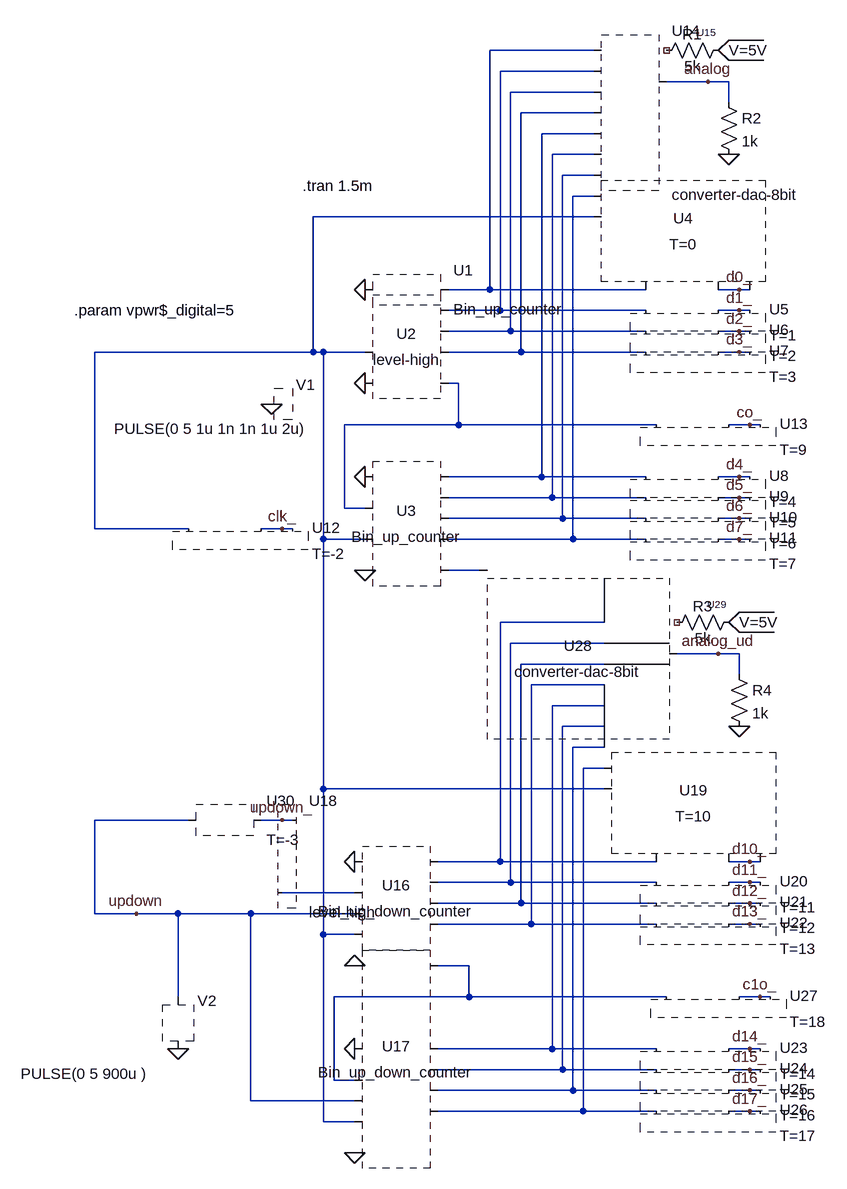
[diagram p0: schematic couter_tst.asc]
couter_tst.asc, the LTspice schematic file:
Version 4
SHEET 1 880 1568
WIRE 528 -240 368 -240
WIRE 528 -208 384 -208
WIRE 704 -192 640 -192
WIRE 736 -192 704 -192
WIRE 528 -176 400 -176
WIRE 736 -160 736 -192
WIRE 528 -144 416 -144
WIRE 528 -112 448 -112
WIRE 528 -80 464 -80
WIRE 528 -48 480 -48
WIRE 528 -16 496 -16
WIRE 528 16 96 16
WIRE 368 128 368 -240
WIRE 368 128 304 128
WIRE 608 128 368 128
WIRE 752 128 720 128
WIRE 768 128 752 128
WIRE 384 160 384 -208
WIRE 384 160 304 160
WIRE 608 160 384 160
WIRE 752 160 720 160
WIRE 768 160 752 160
WIRE 400 192 400 -176
WIRE 400 192 304 192
WIRE 608 192 400 192
WIRE 752 192 720 192
WIRE 768 192 752 192
WIRE 32 224 -240 224
WIRE 96 224 96 16
WIRE 96 224 32 224
WIRE 112 224 96 224
WIRE 176 224 112 224
WIRE 416 224 416 -144
WIRE 416 224 304 224
WIRE 608 224 416 224
WIRE 752 224 720 224
WIRE 768 224 752 224
WIRE 320 272 304 272
WIRE 320 336 320 272
WIRE 320 336 144 336
WIRE 624 336 320 336
WIRE 768 336 736 336
WIRE 784 336 768 336
WIRE 448 416 448 -112
WIRE 448 416 304 416
WIRE 608 416 448 416
WIRE 752 416 720 416
WIRE 768 416 752 416
WIRE 464 448 464 -80
WIRE 464 448 304 448
WIRE 608 448 464 448
WIRE 752 448 720 448
WIRE 768 448 752 448
WIRE 144 464 144 336
WIRE 176 464 144 464
WIRE 480 480 480 -48
WIRE 480 480 304 480
WIRE 608 480 480 480
WIRE 752 480 720 480
WIRE 768 480 752 480
WIRE -240 496 -240 224
WIRE -96 496 -240 496
WIRE 48 496 16 496
WIRE 64 496 48 496
WIRE 112 512 112 224
WIRE 176 512 112 512
WIRE 496 512 496 -16
WIRE 496 512 304 512
WIRE 608 512 496 512
WIRE 752 512 720 512
WIRE 768 512 752 512
WIRE 352 560 304 560
WIRE 544 640 384 640
WIRE 544 672 400 672
WIRE 720 688 656 688
WIRE 752 688 720 688
WIRE 544 704 416 704
WIRE 752 720 752 688
WIRE 544 736 432 736
WIRE 544 768 464 768
WIRE 544 800 480 800
WIRE 544 832 496 832
WIRE 544 864 512 864
WIRE 112 896 112 512
WIRE 544 896 112 896
WIRE -96 944 -240 944
WIRE 48 944 16 944
WIRE 64 944 48 944
WIRE 384 1008 384 640
WIRE 384 1008 288 1008
WIRE 624 1008 384 1008
WIRE 768 1008 736 1008
WIRE 784 1008 768 1008
WIRE 400 1040 400 672
WIRE 400 1040 288 1040
WIRE 624 1040 400 1040
WIRE 768 1040 736 1040
WIRE 784 1040 768 1040
WIRE 160 1056 48 1056
WIRE 416 1072 416 704
WIRE 416 1072 288 1072
WIRE 624 1072 416 1072
WIRE 768 1072 736 1072
WIRE 784 1072 768 1072
WIRE -240 1088 -240 944
WIRE -176 1088 -240 1088
WIRE -112 1088 -176 1088
WIRE 0 1088 -112 1088
WIRE 160 1088 0 1088
WIRE 432 1104 432 736
WIRE 432 1104 288 1104
WIRE 624 1104 432 1104
WIRE 768 1104 736 1104
WIRE 784 1104 768 1104
WIRE 112 1120 112 896
WIRE 160 1120 112 1120
WIRE 336 1168 288 1168
WIRE -112 1216 -112 1088
WIRE 336 1216 336 1168
WIRE 336 1216 128 1216
WIRE 640 1216 336 1216
WIRE 784 1216 752 1216
WIRE 800 1216 784 1216
WIRE 464 1296 464 768
WIRE 464 1296 288 1296
WIRE 624 1296 464 1296
WIRE 768 1296 736 1296
WIRE 784 1296 768 1296
WIRE 480 1328 480 800
WIRE 480 1328 288 1328
WIRE 624 1328 480 1328
WIRE 768 1328 736 1328
WIRE 784 1328 768 1328
WIRE 128 1344 128 1216
WIRE 160 1344 128 1344
WIRE 496 1360 496 832
WIRE 496 1360 288 1360
WIRE 624 1360 496 1360
WIRE 768 1360 736 1360
WIRE 784 1360 768 1360
WIRE 0 1376 0 1088
WIRE 160 1376 0 1376
WIRE 512 1392 512 864
WIRE 512 1392 288 1392
WIRE 624 1392 512 1392
WIRE 768 1392 736 1392
WIRE 784 1392 768 1392
WIRE 112 1408 112 1120
WIRE 160 1408 112 1408
FLAG 176 272 0
FLAG 176 128 0
FLAG 32 304 0
FLAG 176 416 0
FLAG 176 560 0
FLAG 752 128 d0_
FLAG 752 160 d1_
FLAG 752 192 d2_
FLAG 752 224 d3_
FLAG 752 416 d4_
FLAG 752 448 d5_
FLAG 752 480 d6_
FLAG 752 512 d7_
FLAG 48 496 clk_
FLAG 768 336 co_
FLAG 704 -192 analog
FLAG 736 -80 0
FLAG 160 1008 0
FLAG 160 1168 0
FLAG 160 1456 0
FLAG 160 1296 0
FLAG -112 1296 0
FLAG 768 1008 d10_
FLAG 768 1040 d11_
FLAG 768 1072 d12_
FLAG 768 1104 d13_
FLAG 768 1296 d14_
FLAG 768 1328 d15_
FLAG 768 1360 d16_
FLAG 768 1392 d17_
FLAG 784 1216 c1o_
FLAG 720 688 analog_ud
FLAG 752 800 0
FLAG 48 944 updown_
FLAG -176 1088 updown
SYMBOL Source-V 32 208 R0
WINDOW 3 -242 134 Left 0
WINDOW 123 0 0 Left 0
WINDOW 39 0 0 Left 0
SYMATTR Value PULSE(0 5 1u 1n 1n 1u 2u)
SYMATTR InstName V1
SYMBOL EIT_Digital\\probe_dig 608 112 R0
SYMATTR Value T=0
SYMATTR InstName U4
SYMBOL EIT_Digital\\probe_dig 608 144 R0
SYMATTR Value T=1
SYMATTR InstName U5
SYMBOL EIT_Digital\\probe_dig 608 176 R0
SYMATTR Value T=2
SYMATTR InstName U6
SYMBOL EIT_Digital\\probe_dig 608 208 R0
SYMATTR Value T=3
SYMATTR InstName U7
SYMBOL EIT_Digital\\probe_dig 608 400 R0
SYMATTR Value T=4
SYMATTR InstName U8
SYMBOL EIT_Digital\\probe_dig 608 432 R0
SYMATTR Value T=5
SYMATTR InstName U9
SYMBOL EIT_Digital\\probe_dig 608 464 R0
SYMATTR Value T=6
SYMATTR InstName U10
SYMBOL EIT_Digital\\probe_dig 608 496 R0
SYMATTR Value T=7
SYMATTR InstName U11
SYMBOL EIT_Digital\\Bin_up_counter 176 128 R0
SYMATTR InstName U1
SYMBOL EIT_Digital\\Bin_up_counter 176 416 R0
SYMATTR InstName U3
SYMBOL EIT_Digital\\probe_dig -96 480 R0
SYMATTR Value T=-2
SYMATTR InstName U12
SYMBOL EIT_Digital\\level-high 176 176 R0
SYMATTR InstName U2
SYMBOL EIT_Digital\\probe_dig 624 320 R0
SYMATTR Value T=9
SYMATTR InstName U13
SYMBOL EIT_Digital\\converter-dac-8bit 528 -240 R0
SYMATTR InstName U14
SYMBOL res 736 -256 R90
WINDOW 0 7 56 VBottom 0
WINDOW 3 25 56 VTop 0
SYMATTR InstName R1
SYMATTR Value 5k
SYMBOL source-vmarker 720 -240 M0
SYMATTR InstName U15
SYMBOL res 720 -176 R0
SYMATTR InstName R2
SYMATTR Value 1k
SYMBOL EIT_Digital\\Bin_up_down_counter 160 1008 R0
SYMATTR InstName U16
SYMBOL EIT_Digital\\Bin_up_down_counter 160 1296 R0
SYMATTR InstName U17
SYMBOL Source-V -112 1200 R0
WINDOW 3 -242 134 Left 0
WINDOW 123 0 0 Left 0
WINDOW 39 0 0 Left 0
SYMATTR Value PULSE(0 5 900u )
SYMATTR InstName V2
SYMBOL EIT_Digital\\level-high 48 1056 R0
SYMATTR InstName U18
SYMBOL EIT_Digital\\probe_dig 624 992 R0
SYMATTR Value T=10
SYMATTR InstName U19
SYMBOL EIT_Digital\\probe_dig 624 1024 R0
SYMATTR Value T=11
SYMATTR InstName U20
SYMBOL EIT_Digital\\probe_dig 624 1056 R0
SYMATTR Value T=12
SYMATTR InstName U21
SYMBOL EIT_Digital\\probe_dig 624 1088 R0
SYMATTR Value T=13
SYMATTR InstName U22
SYMBOL EIT_Digital\\probe_dig 624 1280 R0
SYMATTR Value T=14
SYMATTR InstName U23
SYMBOL EIT_Digital\\probe_dig 624 1312 R0
SYMATTR Value T=15
SYMATTR InstName U24
SYMBOL EIT_Digital\\probe_dig 624 1344 R0
SYMATTR Value T=16
SYMATTR InstName U25
SYMBOL EIT_Digital\\probe_dig 624 1376 R0
SYMATTR Value T=17
SYMATTR InstName U26
SYMBOL EIT_Digital\\probe_dig 640 1200 R0
SYMATTR Value T=18
SYMATTR InstName U27
SYMBOL EIT_Digital\\converter-dac-8bit 544 640 R0
SYMATTR InstName U28
SYMBOL res 752 624 R90
WINDOW 0 7 56 VBottom 0
WINDOW 3 25 56 VTop 0
SYMATTR InstName R3
SYMATTR Value 5k
SYMBOL source-vmarker 736 640 M0
SYMATTR InstName U29
SYMBOL res 736 704 R0
SYMATTR InstName R4
SYMATTR Value 1k
SYMBOL EIT_Digital\\probe_dig -96 928 R0
SYMATTR Value T=-3
SYMATTR InstName U30
TEXT 80 -32 Left 0 !.tran 1.5m
TEXT -272 160 Left 0 !.param vpwr$_digital=5

The netlist it stands for:
* couter_tst.asc
* V1: PULSE(0 5 1u 1n 1n 1u 2u) (symbol Source-V not available, pin order unknown); nets seen at it: 0
* U4: T=0 (symbol EIT_Digital\probe_dig not available, pin order unknown); nets seen at it: d0_, N001, N008, N009
* U5: T=1 (symbol EIT_Digital\probe_dig not available, pin order unknown); nets seen at it: d1_, N002
* U6: T=2 (symbol EIT_Digital\probe_dig not available, pin order unknown); nets seen at it: d2_, N003
* U7: T=3 (symbol EIT_Digital\probe_dig not available, pin order unknown); nets seen at it: d3_, N004
* U8: T=4 (symbol EIT_Digital\probe_dig not available, pin order unknown); nets seen at it: d4_, N005
* U9: T=5 (symbol EIT_Digital\probe_dig not available, pin order unknown); nets seen at it: d5_, N006
* U10: T=6 (symbol EIT_Digital\probe_dig not available, pin order unknown); nets seen at it: d6_, N007
* U11: T=7 (symbol EIT_Digital\probe_dig not available, pin order unknown); nets seen at it: d7_, N008
* U1: Bin_up_counter (symbol EIT_Digital\Bin_up_counter not available, pin order unknown); nets seen at it: 0, N001
* U3: Bin_up_counter (symbol EIT_Digital\Bin_up_counter not available, pin order unknown); nets seen at it: 0, N005, N006, N007, N008, N009, N010, N011
* U12: T=-2 (symbol EIT_Digital\probe_dig not available, pin order unknown); nets seen at it: clk_, N009
* U2: level-high (symbol EIT_Digital\level-high not available, pin order unknown); nets seen at it: 0, N002, N003, N004, N009, N010
* U13: T=9 (symbol EIT_Digital\probe_dig not available, pin order unknown); nets seen at it: co_, N010
* U14: converter-dac-8bit (symbol EIT_Digital\converter-dac-8bit not available, pin order unknown); nets seen at it: analog, N001, N002, N003, N004, N005, N006, N007
R1 P001 NC_01 5k
XU15 P001 vdc_single V=5V  ; pins in
R2 analog 0 1k
* U16: Bin_up_down_counter (symbol EIT_Digital\Bin_up_down_counter not available, pin order unknown); nets seen at it: 0, N009, N012, N013, N014, N015, N020, updown
* U17: Bin_up_down_counter (symbol EIT_Digital\Bin_up_down_counter not available, pin order unknown); nets seen at it: 0, N009, N016, N017, N018, N019, N021, updown
* V2: PULSE(0 5 900u ) (symbol Source-V not available, pin order unknown); nets seen at it: 0, updown
* U18: level-high (symbol EIT_Digital\level-high not available, pin order unknown); nets seen at it: N020, updown_
* U19: T=10 (symbol EIT_Digital\probe_dig not available, pin order unknown); nets seen at it: d10_, N009, N012, N019
* U20: T=11 (symbol EIT_Digital\probe_dig not available, pin order unknown); nets seen at it: d11_, N013
* U21: T=12 (symbol EIT_Digital\probe_dig not available, pin order unknown); nets seen at it: d12_, N014
* U22: T=13 (symbol EIT_Digital\probe_dig not available, pin order unknown); nets seen at it: d13_, N015
* U23: T=14 (symbol EIT_Digital\probe_dig not available, pin order unknown); nets seen at it: d14_, N016
* U24: T=15 (symbol EIT_Digital\probe_dig not available, pin order unknown); nets seen at it: d15_, N017
* U25: T=16 (symbol EIT_Digital\probe_dig not available, pin order unknown); nets seen at it: d16_, N018
* U26: T=17 (symbol EIT_Digital\probe_dig not available, pin order unknown); nets seen at it: d17_, N019
* U27: T=18 (symbol EIT_Digital\probe_dig not available, pin order unknown); nets seen at it: c1o_, N021
* U28: converter-dac-8bit (symbol EIT_Digital\converter-dac-8bit not available, pin order unknown); nets seen at it: analog_ud, N011, N012, N013, N014, N015, N016, N017, N018
R3 P002 NC_02 5k
XU29 P002 vdc_single V=5V  ; pins in
R4 analog_ud 0 1k
* U30: T=-3 (symbol EIT_Digital\probe_dig not available, pin order unknown); nets seen at it: updown, updown_
.tran 1.5m
.param vpwr$_digital=5
.lib EIT_sub/vdc_single.sub
.backanno
.end